# EAGLE design Sensors (EAGLE 9.4.0)

## Sheet 1 of 2: Main This sheet contains the Arduino Mega pin layout and status LEDs. A list of the pins used on the Arduino for programmer's reference: Accelerometer: D20 (SDA), D21 (SCL) Thermocouple 1: D28 (THERMO1_LED), D22 (MAXCS1) Thermocouple 2: D30 (THERMO2_LED), D33 (MAXCS2) Thermocouple 3: D32 (THERMO3_LED), D31 (MAXCS3) All Thermocouples: D24 (MAXDO), D52 (MAXCLK) Load Cell: D34 (FORCE_LED), D2 (FORCE_DAT), D26 (FORCE_CLK) Pressure 1: D36 (PRESSURE1_LED), A2 (VOUT_PRESSURE_1) Pressure 2: D50 (PRESSURE2_LED), A3 (VOUT_PRESSURE_2) Analog Temp Sensor 1: D46 (TEMP1_LED), A4 (VOUT_TEMPERATURE_1) Analog Temp Sensor 2: D48 (TEMP2_LED), A5 (VOUT_TEMPERATURE_2) LEDs: D42 (STATE_LED), D44 (STATUS_LED)
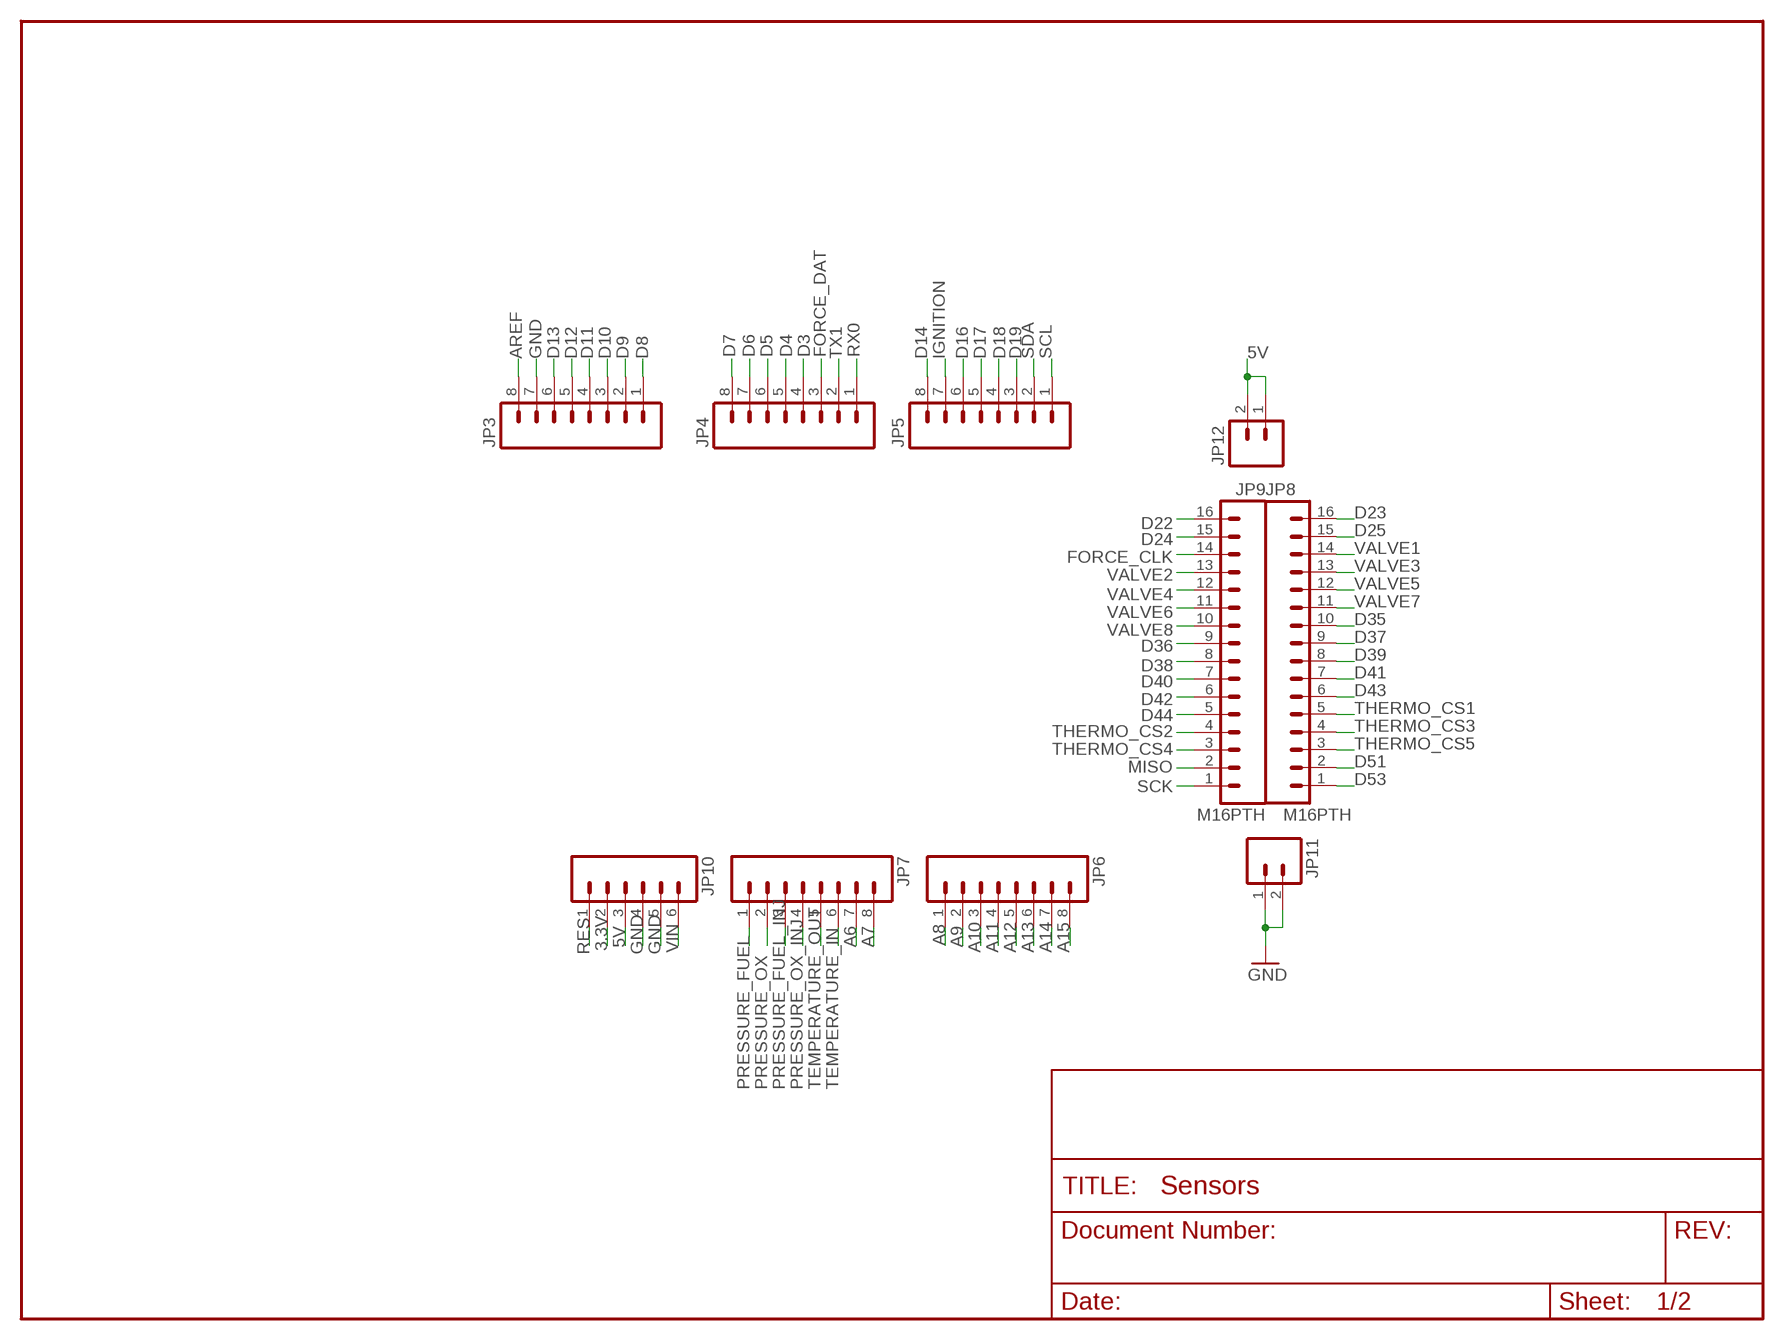
[diagram p0: schematic, sheet 1]

### Parts
JP3  M08  [1X08]
JP4  M08  [1X08]
JP5  M08  [1X08]
JP6  M08  [1X08]
JP7  M08  [1X08]
JP8  M16PTH  [1X16]
JP9  M16PTH  [1X16]
JP10  M06SIP  [1X06]
JP11  M02PTH  [1X02]
JP12  M02PTH  [1X02]

### Nets
3.3V: JP10.2
5V: JP10.3 JP12.1 JP12.2 ; also sheet 2
A6: JP7.7
A7: JP7.8
A8: JP6.1
A9: JP6.2
A10: JP6.3
A11: JP6.4
A12: JP6.5
A13: JP6.6
A14: JP6.7
A15: JP6.8
AREF: JP3.8
D3: JP4.4
D4: JP4.5
D5: JP4.6
D6: JP4.7
D7: JP4.8
D8: JP3.1
D9: JP3.2
D10: JP3.3
D11: JP3.4
D12: JP3.5
D13: JP3.6
D14: JP5.8
D16: JP5.6
D17: JP5.5
D18: JP5.4
D19: JP5.3
D22: JP9.16
D23: JP8.16
D24: JP9.15
D25: JP8.15
D35: JP8.10
D36: JP9.9
D37: JP8.9
D38: JP9.8
D39: JP8.8
D40: JP9.7
D41: JP8.7
D42: JP9.6
D43: JP8.6
D44: JP9.5
D51: JP8.2
D53: JP8.1
FORCE_CLK: JP9.14 ; also sheet 2
FORCE_DAT: JP4.3 ; also sheet 2
GND: JP3.7 JP10.4 JP10.5 JP11.1 JP11.2 ; also sheet 2
IGNITION: JP5.7
MISO: JP9.2 ; also sheet 2
PRESSURE_FUEL: JP7.1 ; also sheet 2
PRESSURE_FUEL_INJ: JP7.3 ; also sheet 2
PRESSURE_OX: JP7.2 ; also sheet 2
PRESSURE_OX_INJ: JP7.4 ; also sheet 2
RES: JP10.1
RX0: JP4.1
SCK: JP9.1 ; also sheet 2
SCL: JP5.1 ; also sheet 2
SDA: JP5.2 ; also sheet 2
TEMPERATURE_IN: JP7.6 ; also sheet 2
TEMPERATURE_OUT: JP7.5 ; also sheet 2
THERMO_CS1: JP8.5 ; also sheet 2
THERMO_CS2: JP9.4 ; also sheet 2
THERMO_CS3: JP8.4 ; also sheet 2
THERMO_CS4: JP9.3 ; also sheet 2
THERMO_CS5: JP8.3 ; also sheet 2
TX1: JP4.2
VALVE1: JP8.14
VALVE2: JP9.13
VALVE3: JP8.13
VALVE4: JP9.12
VALVE5: JP8.12
VALVE6: JP9.11
VALVE7: JP8.11
VALVE8: JP9.10
VIN: JP10.6

## Sheet 2 of 2: Sensors This sheet contains the following sensor elements J1: MMA8451 accelerometer female 8-pin connector J5 & J11: PS-AN2 ASIC pressure sensor 3-pin screw connector J3 & J4: HX711 load cell 5-pin female connector J10: 4-pin screw connector for load cell wires J7, J8 & J9: K-Type Thermocouple 2-pin screw connector IC1, IC2 & IC3: MAX31855 thermocouple amplifier surface mounts J2: LM35DXB temperature sensor 4 pin connector
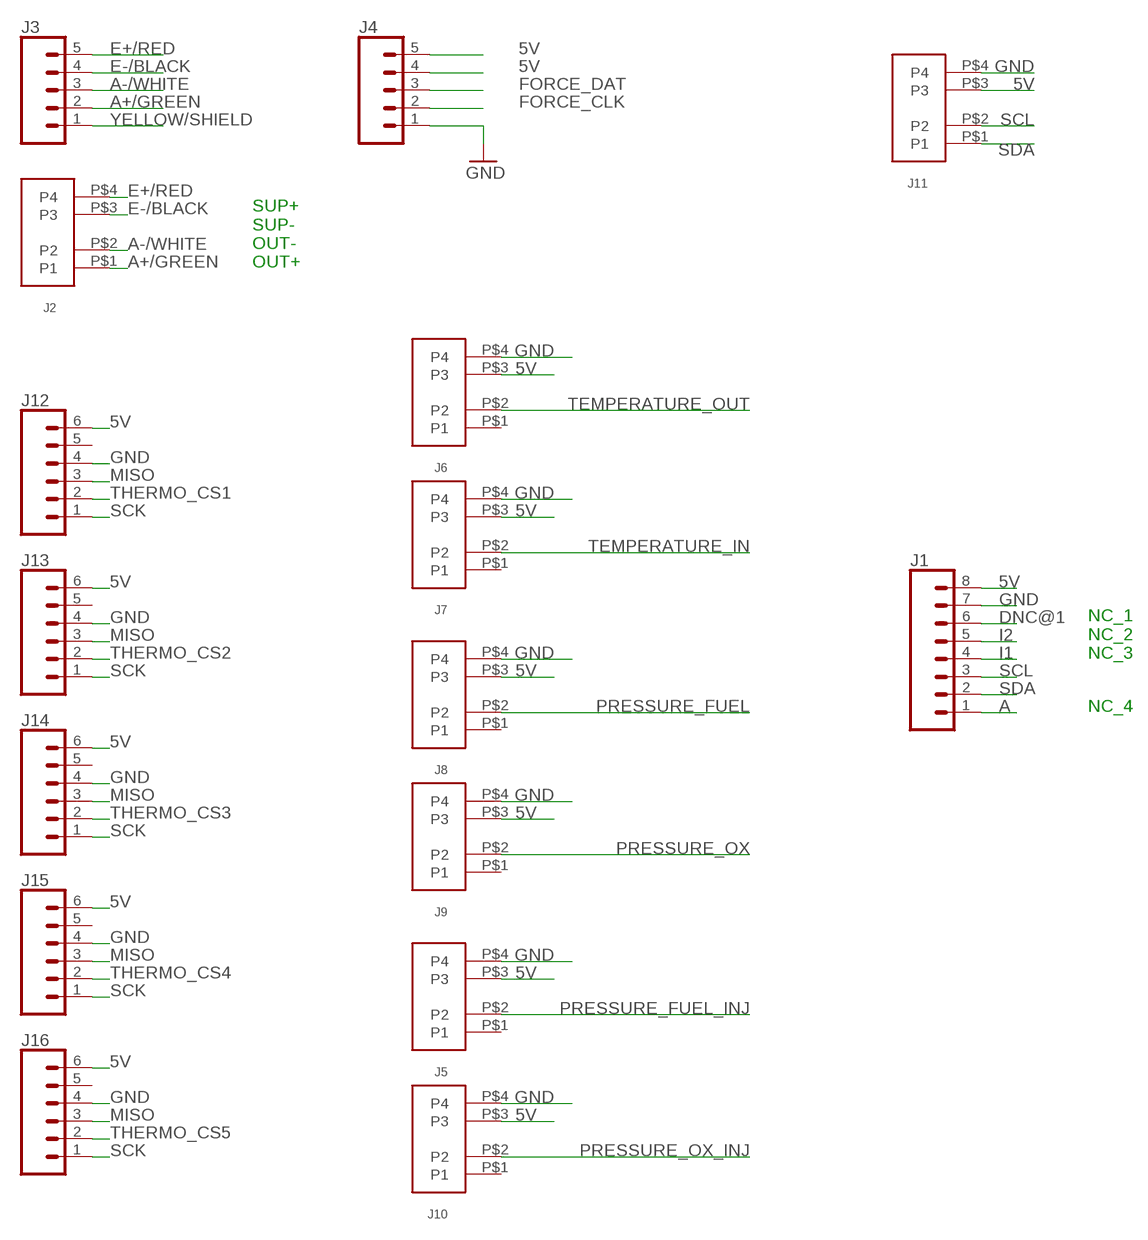
[diagram p1: schematic, sheet 2]

### Parts
J1  CONN_08"  [1X08]
J2  JST_CONNECTOR  [B4B-XH-A(LF)(SN)]
J3  CONN_05  [1X05]
J4  CONN_05  [1X05]
J5  JST_CONNECTOR  [B4B-XH-A(LF)(SN)]
J6  JST_CONNECTOR  [B4B-XH-A(LF)(SN)]
J7  JST_CONNECTOR  [B4B-XH-A(LF)(SN)]
J8  JST_CONNECTOR  [B4B-XH-A(LF)(SN)]
J9  JST_CONNECTOR  [B4B-XH-A(LF)(SN)]
J10  JST_CONNECTOR  [B4B-XH-A(LF)(SN)]
J11  JST_CONNECTOR  [B4B-XH-A(LF)(SN)]
J12  CONN_06SILK_FEMALE_PTH  [1X06]
J13  CONN_06SILK_FEMALE_PTH  [1X06]
J14  CONN_06SILK_FEMALE_PTH  [1X06]
J15  CONN_06SILK_FEMALE_PTH  [1X06]
J16  CONN_06SILK_FEMALE_PTH  [1X06]

### Nets
5V: J1.8 J4.4 J4.5 J5.P$3(P3) J6.P$3(P3) J7.P$3(P3) J8.P$3(P3) J9.P$3(P3) J10.P$3(P3) J11.P$3(P3) J12.6 J13.6 J14.6 J15.6 J16.6 ; also sheet 1
A: J1.1
A+/GREEN: J2.P$1(P1) J3.2
A-/WHITE: J2.P$2(P2) J3.3
DNC@1: J1.6
E+/RED: J2.P$4(P4) J3.5
E-/BLACK: J2.P$3(P3) J3.4
FORCE_CLK: J4.2 ; also sheet 1
FORCE_DAT: J4.3 ; also sheet 1
GND: J1.7 J4.1 J5.P$4(P4) J6.P$4(P4) J7.P$4(P4) J8.P$4(P4) J9.P$4(P4) J10.P$4(P4) J11.P$4(P4) J12.4 J13.4 J14.4 J15.4 J16.4 ; also sheet 1
I1: J1.4
I2: J1.5
MISO: J12.3 J13.3 J14.3 J15.3 J16.3 ; also sheet 1
PRESSURE_FUEL: J8.P$2(P2) ; also sheet 1
PRESSURE_FUEL_INJ: J5.P$2(P2) ; also sheet 1
PRESSURE_OX: J9.P$2(P2) ; also sheet 1
PRESSURE_OX_INJ: J10.P$2(P2) ; also sheet 1
SCK: J12.1 J13.1 J14.1 J15.1 J16.1 ; also sheet 1
SCL: J1.3 J11.P$2(P2) ; also sheet 1
SDA: J1.2 J11.P$1(P1) ; also sheet 1
TEMPERATURE_IN: J7.P$2(P2) ; also sheet 1
TEMPERATURE_OUT: J6.P$2(P2) ; also sheet 1
THERMO_CS1: J12.2 ; also sheet 1
THERMO_CS2: J13.2 ; also sheet 1
THERMO_CS3: J14.2 ; also sheet 1
THERMO_CS4: J15.2 ; also sheet 1
THERMO_CS5: J16.2 ; also sheet 1
YELLOW/SHIELD: J3.1
Unconnected: J5.P$1(P1) J6.P$1(P1) J7.P$1(P1) J8.P$1(P1) J9.P$1(P1) J10.P$1(P1) J12.5 J13.5 J14.5 J15.5 J16.5

### Notes on the sheet
- SUP+
  SUP-
  OUT-
  OUT+
- NC_1
  NC_2
  NC_3
- NC_4

## Library data of the parts
J1 = SparkFun-Connectors:CONN_08: Multi connection point. Often used as Generic Header-pin footprint for 0.1 inch spaced/style header connections On any of the 0.1 inch spaced packages, you can populate with these: Break Away Headers - Straight <https://www.sparkfun.com/products/116> (PRT-00116) Break Away Male Headers - Right Angle <https://www.sparkfun.com/products/553> (PRT-00553) Female Headers <https://www.sparkfun.com/products/115> (PRT-00115) Break Away Headers - Machine Pin <https://www.sparkfun.com/products/117> (PRT-00117) Break Away Female Headers - Swiss Machine Pin <https://www.sparkfun.com/products/743> (PRT-00743) Arduino Stackable Header - 8 Pin <https://www.sparkfun.com/products/9279> (PRT-09279) For SCREWTERMINALS and SPRING TERMINALS visit here: Screw Terimnals on SparkFun.com <https://www.sparkfun.com/search/results?term=Screw+Terminals> (5mm/3.5mm/2.54mm spacing) This device is also useful as a general connection point to wire up your design to another part of your project. Our various solder wires solder well into these plated through hole pads. Hook-Up Wire - Assortment (Stranded, 22 AWG) <https://www.sparkfun.com/products/11375> (PRT-11375) Hook-Up Wire - Assortment (Solid Core, 22 AWG) <https://www.sparkfun.com/products/11367> (PRT-11367) View the entire wire category on our website here <https://www.sparkfun.com/categories/141> Special notes: Molex polarized connector foot print use with SKU : PRT-08231 with associated crimp pins and housings. 1MM SMD Version SKU: PRT-10208 NOTES ON THE VARIANTS LOCK and LOCK_LONGPADS... This footprint was designed to help hold the alignment of a through-hole component (i.e. 6-pin header) while soldering it into place. You may notice that each hole has been shifted either up or down by 0.005 of an inch from it's more standard position (which is a perfectly straight line). This slight alteration caused the pins (the squares in the middle) to touch the edges of the holes. Because they are alternating, it causes a "brace" to hold the component in place. 0.005 has proven to be the perfect amount of "off-center" position when using our standard breakaway headers. Although looks a little odd when you look at the bare footprint, once you have a header in there, the alteration is very hard to notice. Also,if you push a header all the way into place, it is covered up entirely on the bottom side.; PROD_ID: CONN-08438
J2 J5-J11 = LPRD_RELAY:JST_CONNECTOR
J3 J4 = SparkFun-Connectors:CONN_05: Multi connection point. Often used as Generic Header-pin footprint for 0.1 inch spaced/style header connections On any of the 0.1 inch spaced packages, you can populate with these: Break Away Headers - Straight <https://www.sparkfun.com/products/116> (PRT-00116) Break Away Male Headers - Right Angle <https://www.sparkfun.com/products/553> (PRT-00553) Female Headers <https://www.sparkfun.com/products/115> (PRT-00115) Break Away Headers - Machine Pin <https://www.sparkfun.com/products/117> (PRT-00117) Break Away Female Headers - Swiss Machine Pin <https://www.sparkfun.com/products/743> (PRT-00743) For SCREWTERMINALS and SPRING TERMINALS visit here: Screw Terimnals on SparkFun.com <https://www.sparkfun.com/search/results?term=Screw+Terminals> (5mm/3.5mm/2.54mm spacing) This device is also useful as a general connection point to wire up your design to another part of your project. Our various solder wires solder well into these plated through hole pads. Hook-Up Wire - Assortment (Stranded, 22 AWG) <https://www.sparkfun.com/products/11375> (PRT-11375) Hook-Up Wire - Assortment (Solid Core, 22 AWG) <https://www.sparkfun.com/products/11367> (PRT-11367) View the entire wire category on our website here <https://www.sparkfun.com/categories/141> Special notes: Molex polarized connector foot print use with SKU : PRT-08231 with associated crimp pins and housings. 1MM SMD Version SKU: PRT-10208
J12-J16 = SparkFun-Connectors:CONN_06: Multi connection point. Often used as Generic Header-pin footprint for 0.1 inch spaced/style header connections On any of the 0.1 inch spaced packages, you can populate with these: Break Away Headers - Straight <https://www.sparkfun.com/products/116> (PRT-00116) Break Away Male Headers - Right Angle <https://www.sparkfun.com/products/553> (PRT-00553) Female Headers <https://www.sparkfun.com/products/115> (PRT-00115) Break Away Headers - Machine Pin <https://www.sparkfun.com/products/117> (PRT-00117) Break Away Female Headers - Swiss Machine Pin <https://www.sparkfun.com/products/743> (PRT-00743) Arduino Stackable Header - 6 Pin <https://www.sparkfun.com/products/9280> (PRT-09280) For SCREWTERMINALS and SPRING TERMINALS visit here: Screw Terimnals on SparkFun.com <https://www.sparkfun.com/search/results?term=Screw+Terminals> (5mm/3.5mm/2.54mm spacing) This device is also useful as a general connection point to wire up your design to another part of your project. Our various solder wires solder well into these plated through hole pads. Hook-Up Wire - Assortment (Stranded, 22 AWG) <https://www.sparkfun.com/products/11375> (PRT-11375) Hook-Up Wire - Assortment (Solid Core, 22 AWG) <https://www.sparkfun.com/products/11367> (PRT-11367) View the entire wire category on our website here <https://www.sparkfun.com/categories/141>; PROD_ID: CONN-08437
JP3-JP7 = SparkFun:M08: Header 8 Standard 8-pin 0.1" header. Use with straight break away headers (SKU : PRT-00116), right angle break away headers (PRT-00553), swiss pins (PRT-00743), machine pins (PRT-00117), and female headers (PRT-00115).
JP8 JP9 = SparkFun:M16
JP10 = SparkFun:M06: Header 6 Standard 6-pin 0.1" header. Use with straight break away headers (SKU : PRT-00116), right angle break away headers (PRT-00553), swiss pins (PRT-00743), machine pins (PRT-00117), and female headers (PRT-00115). Molex polarized connector foot print use with SKU : PRT-08094 with associated crimp pins and housings. NOTES ON THE VARIANTS LOCK and LOCK_LONGPADS... This footprint was designed to help hold the alignment of a through-hole component (i.e. 6-pin header) while soldering it into place. You may notice that each hole has been shifted either up or down by 0.005 of an inch from it's more standard position (which is a perfectly straight line). This slight alteration caused the pins (the squares in the middle) to touch the edges of the holes. Because they are alternating, it causes a "brace" to hold the component in place. 0.005 has proven to be the perfect amount of "off-center" position when using our standard breakaway headers. Although looks a little odd when you look at the bare footprint, once you have a header in there, the alteration is very hard to notice. Also, if you push a header all the way into place, it is covered up entirely on the bottom side. This idea of altering the position of holes to aid alignment will be further integrated into the Sparkfun Library for other footprints. It can help hold any component with 3 or more connection pins.
JP11 JP12 = SparkFun:M02: Header 2 Standard 2-pin 0.1" header. Use with straight break away headers (SKU : PRT-00116), right angle break away headers (PRT-00553), swiss pins (PRT-00743), machine pins (PRT-00117), and female headers (PRT-00115). Molex polarized connector foot print use with SKU : PRT-08233 with associated crimp pins and housings.

## Board
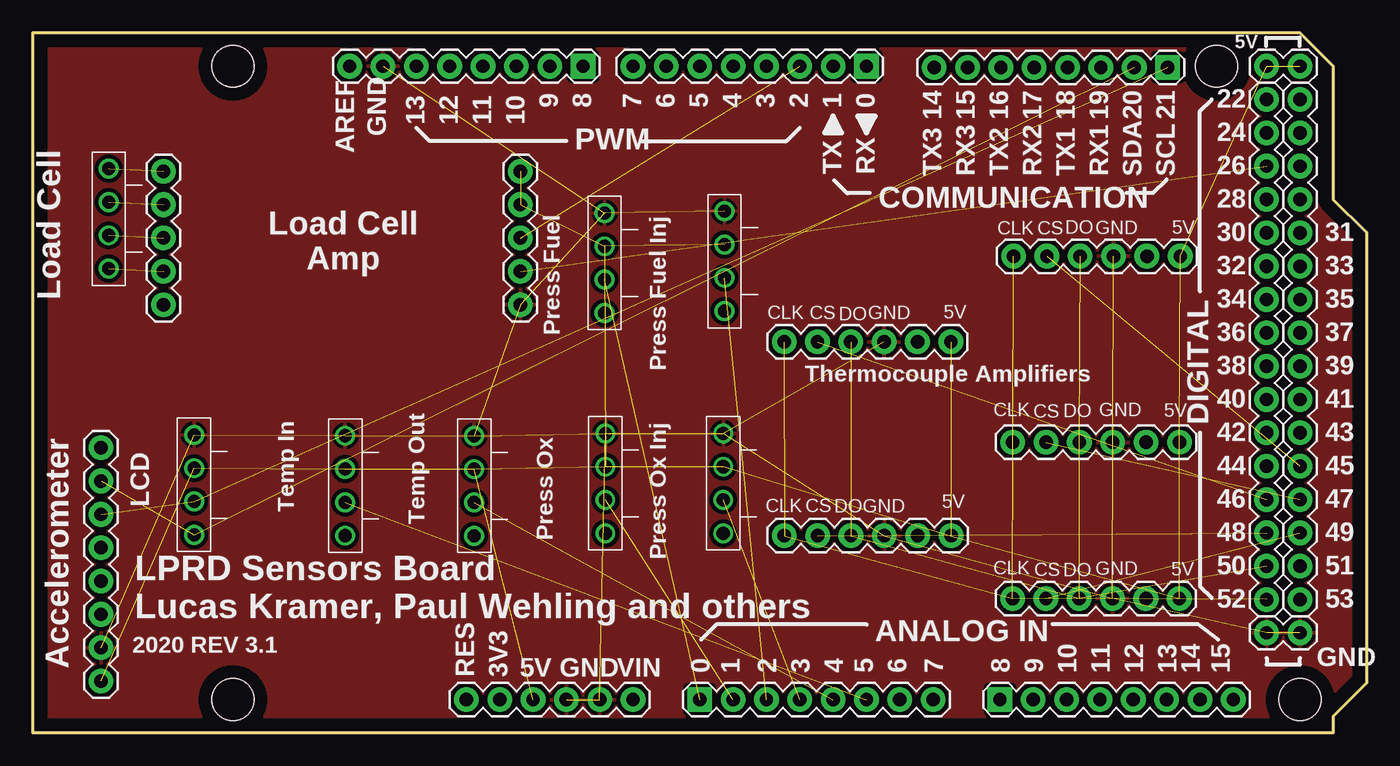
[diagram p2: board, top side]
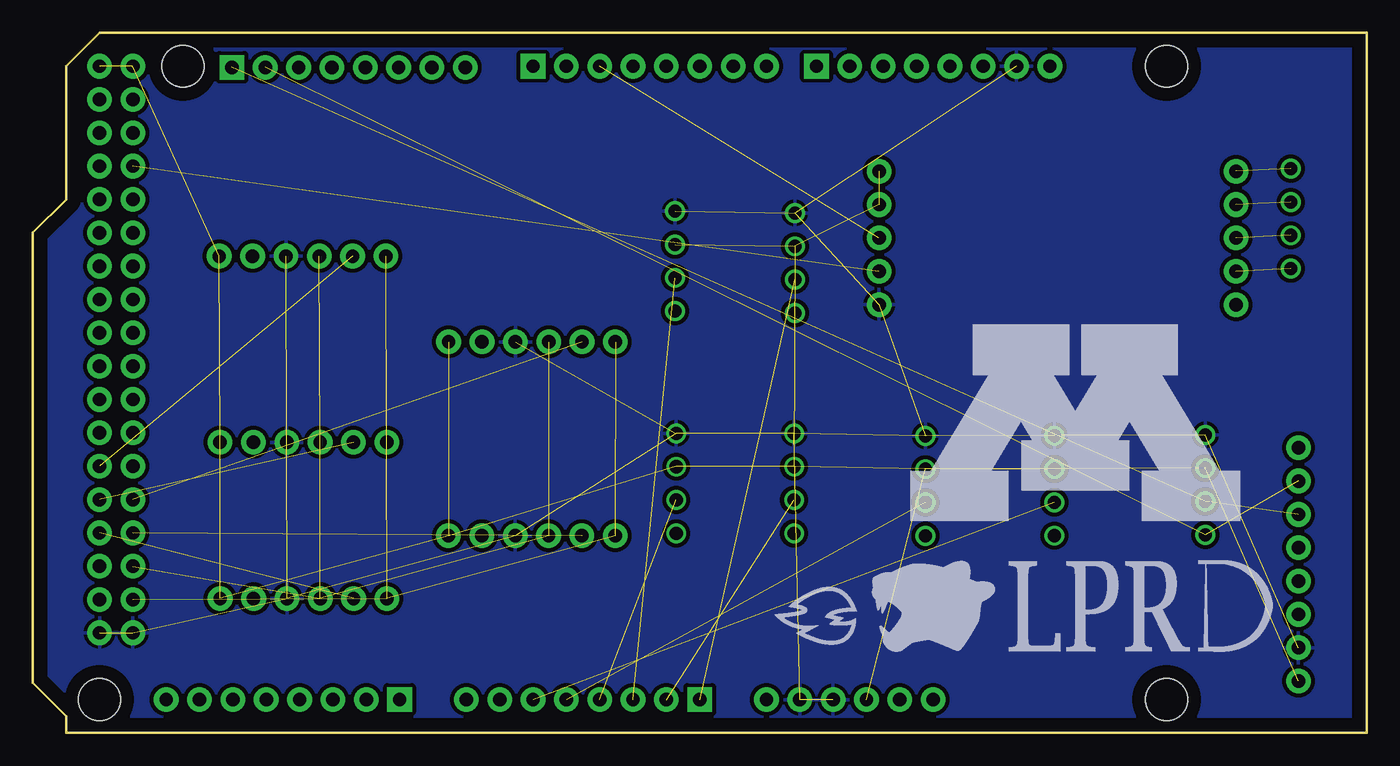
[diagram p3: board, bottom side, seen from below]

Size 101.6 x 53.34 mm. Coordinates in mm from the lower left corner, seen from the top.
Outline: 0,0 99.06,0 99.06,1.27 101.6,3.81 101.6,38.1 99.06,40.64 99.06,50.8 96.52,53.34 0,53.34 0,0
Copper layers (1*16): Top 0.035mm / dielectric 1.5mm / Bottom 0.035mm
Design rules "othermillpro": minimum track width 10mil, minimum drill 16mil, track to track 10mil, track to pad 10mil, pad to pad 10mil, via to via 10mil, smd to smd 6mil, copper to edge 40mil, drill to drill 6mil, minimum pad ring 10mil, minimum via ring 8mil, stop-mask expansion 4mil, vias tented up to drill 0mil, thermal gap 10mil
Holes 3.2 mm at 15.24,50.8 15.24,2.54 90.17,50.8 96.52,2.54

### Footprints (pad centres in the part's own frame; a part is rotated, then mirrored left to right if it is on the bottom)
1X08 = drill 1.016 pad 1.88: 1 0,0; 2 2.54,0; 3 5.08,0; 4 7.62,0; 5 10.16,0; 6 12.7,0; 7 15.24,0; 8 17.78,0
B4B-XH-A(LF)(SN) = drill 1: P$1 -5.08,0; P$2 -2.54,0; P$3 0,0; P$4 2.54,0
1X05 = drill 1.016 pad 1.88: 1 0,0; 2 2.54,0; 3 5.08,0; 4 7.62,0; 5 10.16,0
1X06 = drill 1.016 pad 1.88: 1 0,0; 2 2.54,0; 3 5.08,0; 4 7.62,0; 5 10.16,0; 6 12.7,0
1X08' = drill 1.016 pad 1.88 square: 1 0,0 | drill 1.016 pad 1.88: 2 2.54,0; 3 5.08,0; 4 7.62,0; 5 10.16,0; 6 12.7,0; 7 15.24,0; 8 17.78,0
1X16 = drill 1.016 pad 1.88: 1 0,0; 2 2.54,0; 3 5.08,0; 4 7.62,0; 5 10.16,0; 6 12.7,0; 7 15.24,0; 8 17.78,0; 9 20.32,0; 10 22.86,0; 11 25.4,0; 12 27.94,0; 13 30.48,0; 14 33.02,0; 15 35.56,0; 16 38.1,0
1X02 = drill 1.016 pad 1.88: 1 0,0; 2 2.54,0

### Placement (x,y rotation side)
J1  5.19,21.73 270 top
J2  5.78,40.45 90 top
J3  9.96,32.63 90 top
J4  37.13,32.63 90 top
J5  52.68,37.21 90 top
J6  33.62,20.09 90 top
J7  23.8,20.1 90 top
J8  43.55,37.07 90 top
J9  43.61,20.28 90 top
J10  52.59,20.28 90 top
J11  12.28,20.17 90 top
J12  74.7,36.32 0 top
J13  57.23,29.79 0 top
J14  74.64,22.14 0 top
J15  57.24,15.02 0 top
J16  74.63,10.24 0 top
JP3  [1X08']  41.91,50.8 180 top
JP4  [1X08']  63.5,50.8 180 top
JP5  [1X08']  86.44,50.71 180 top
JP6  [1X08']  73.66,2.54 0 top
JP7  [1X08']  50.8,2.54 0 top
JP8  96.52,10.16 90 top
JP9  93.98,10.16 90 top
JP10  33.02,2.54 0 top
JP11  93.98,7.62 0 top
JP12  93.98,50.8 0 top
T$1  [UMNLOGO]  9.51,16.04 0 top
U$2  [LPRDLOGO]  6.13,2.9 0 top

### Tracks (layer width: path | path; a pad name or v marks a point on that pad's centre or on a via)
5V  (17 unrouted)
A+/GREEN  (1 unrouted)
A-/WHITE  (1 unrouted)
E+/RED  (1 unrouted)
E-/BLACK  (1 unrouted)
FORCE_CLK  (1 unrouted)
FORCE_DAT  (1 unrouted)
GND  (18 unrouted)
  pour Bottom (isolate 0.305): 0,0 99.06,0 99.06,1.27 101.6,3.81 101.6,38.1 99.06,40.64 99.06,50.8 96.52,53.34 0,53.34
  pour Top (isolate 0.305): 0,0 99.06,0 99.06,1.27 101.6,3.81 101.6,38.1 99.06,40.64 99.06,50.8 96.52,53.34 0,53.34
MISO  (5 unrouted)
PRESSURE_FUEL  (1 unrouted)
PRESSURE_FUEL_INJ  (1 unrouted)
PRESSURE_OX  (1 unrouted)
PRESSURE_OX_INJ  (1 unrouted)
SCK  (5 unrouted)
SCL  (2 unrouted)
SDA  (2 unrouted)
TEMPERATURE_IN  (1 unrouted)
TEMPERATURE_OUT  (1 unrouted)
THERMO_CS1  (1 unrouted)
THERMO_CS2  (1 unrouted)
THERMO_CS3  (1 unrouted)
THERMO_CS4  (1 unrouted)
THERMO_CS5  (1 unrouted)

### Text on the board
tPlace: 5V | 9 | 8 | 7 | 6 | 5 | 4 | 3 | 2 | 1 | 0 | 22 | 14 | 15 | 16 | 17 | 18 | 19 | 20 | 21 | 13 | 12 | 11 | 10 | GND | 24 | AREF | PWM | TX | RX | 26 | TX3 | RX3 | TX2 | RX2 | TX1 | RX1 | SDA | SCL | COMMUNICATION | 28 | CLK | CS | DO | GND | 5V | 30 | 31 | Load Cell / Amp | 32 | 33 | Load Cell | CLK | 5V | 34 | 35 | CS | DO | GND | Press Fuel | 36 | 37 | Press Fuel Inj | Thermocouple Amplifiers | 38 | 39 | 40 | 41 | CLK | CS | DO | GND | 5V | DIGITAL | 42 | 43 | 44 | 45 | LCD | Temp In | CLK | CS | DO | GND | 5V | 46 | 47 | Temp Out | Press Ox | 48 | 49 | Press Ox Inj | CLK | CS | DO | GND | 5V | 50 | 51 | 52 | 53 | LPRD Sensors Board / Lucas Kramer, Paul Wehling and others | ANALOG IN | 2020 REV 3.1 | Accelerometer | 0 | 1 | 2 | 3 | 4 | 5 | 6 | 7 | 8 | 9 | 10 | 11 | 12 | 13 | 14 | 15 | GND | RES | 3V3 | 5V | GND | VIN